# EAGLE schematic core (EAGLE 9.6.2)
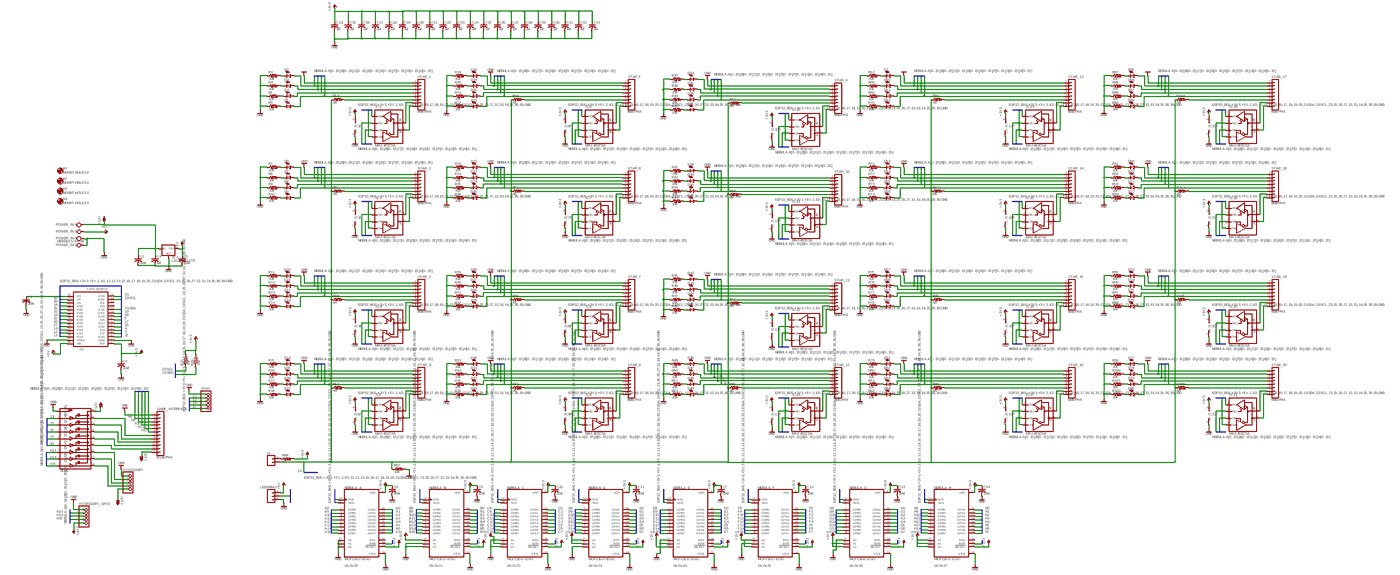
[diagram p0: schematic, sheet 1, overview]
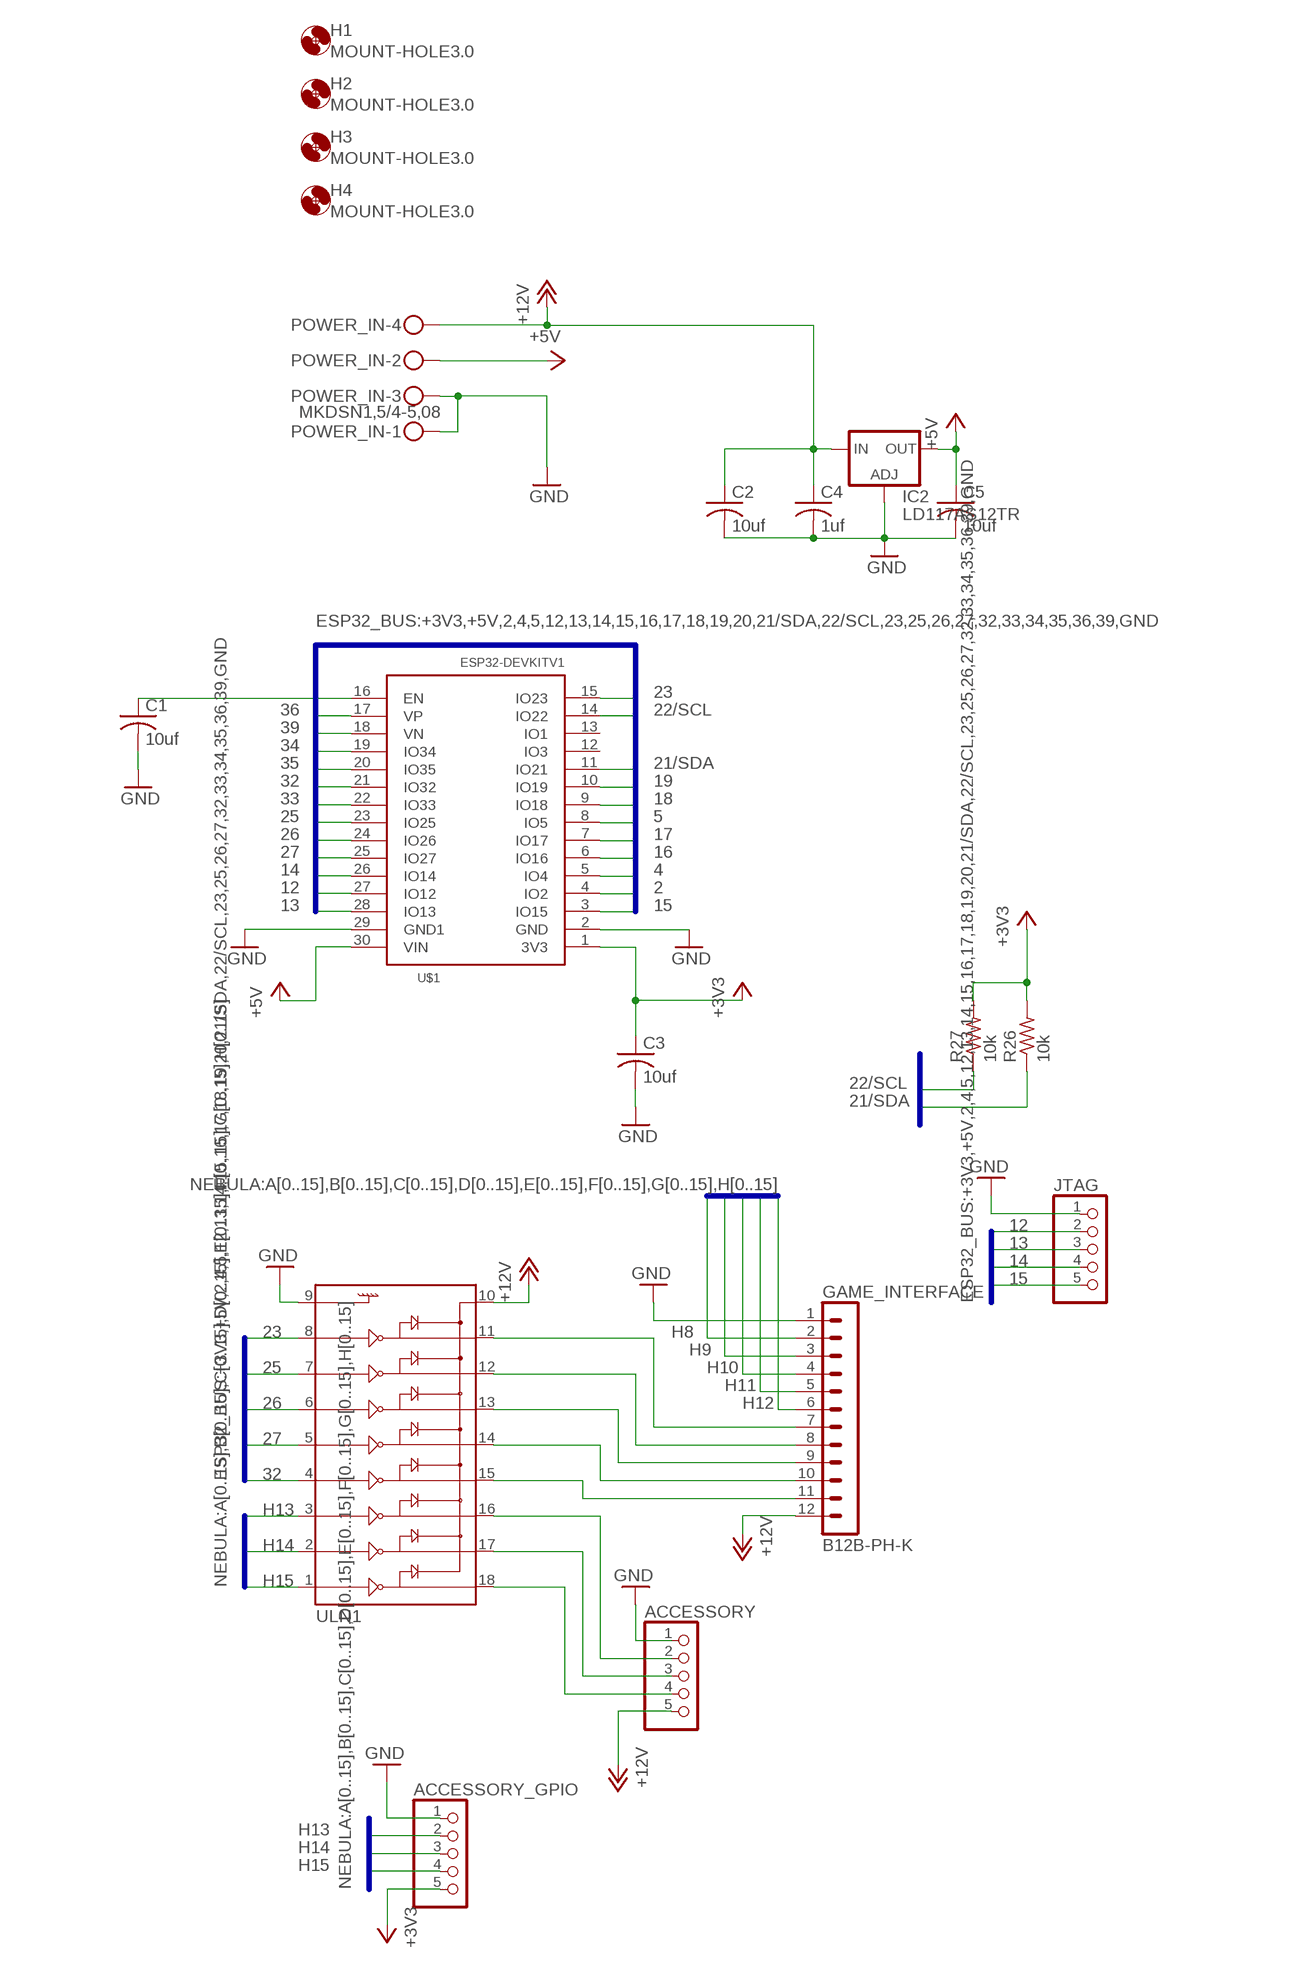
[diagram p1: schematic, sheet 1, part 1 of 4]
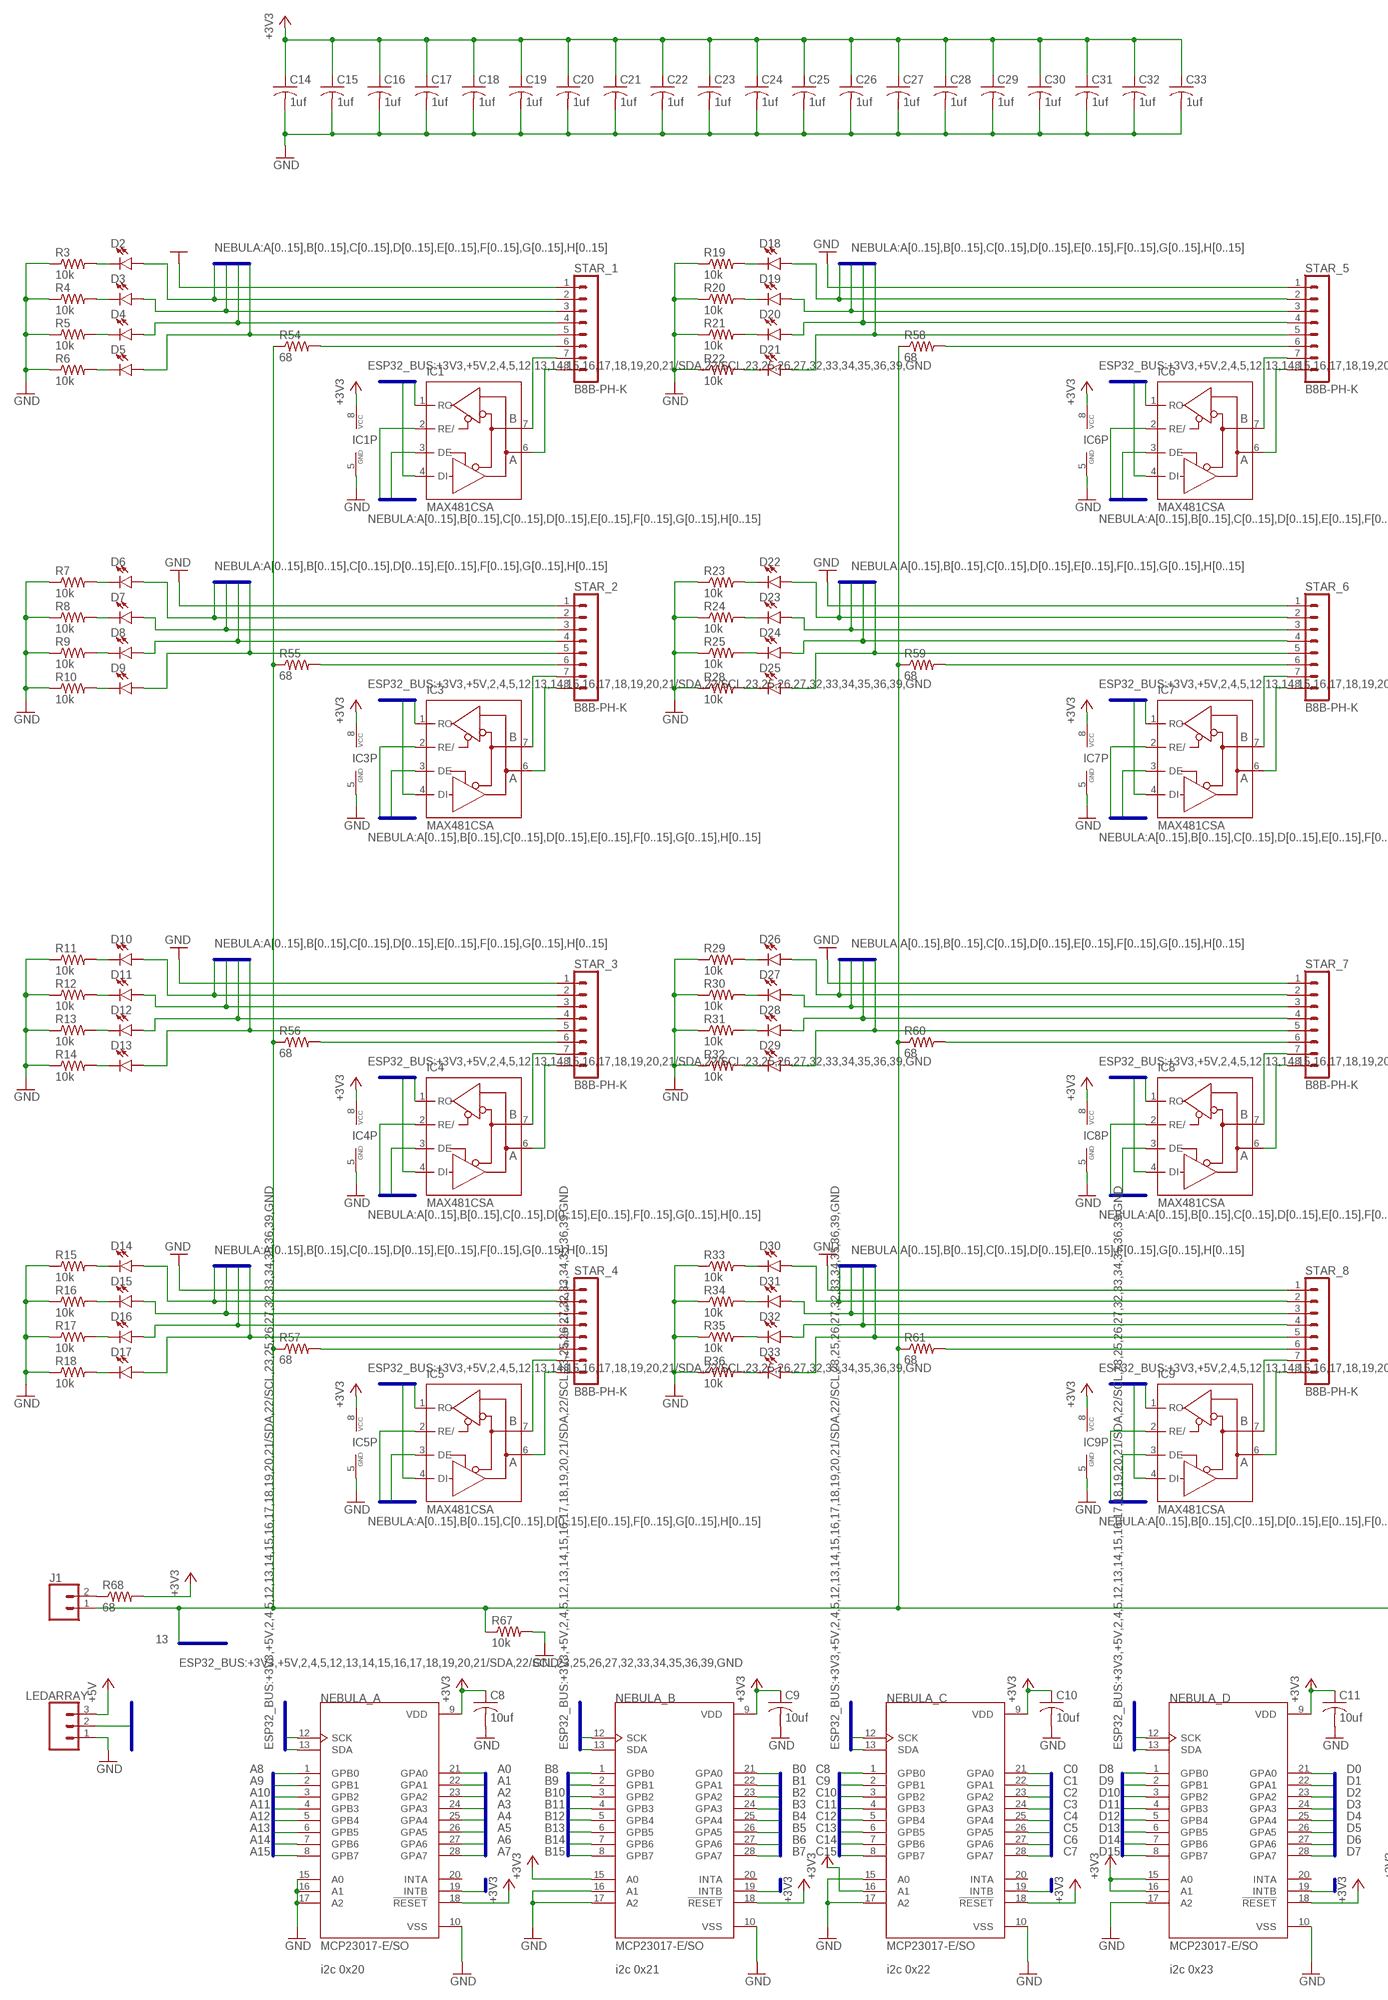
[diagram p2: schematic, sheet 1, part 2 of 4]
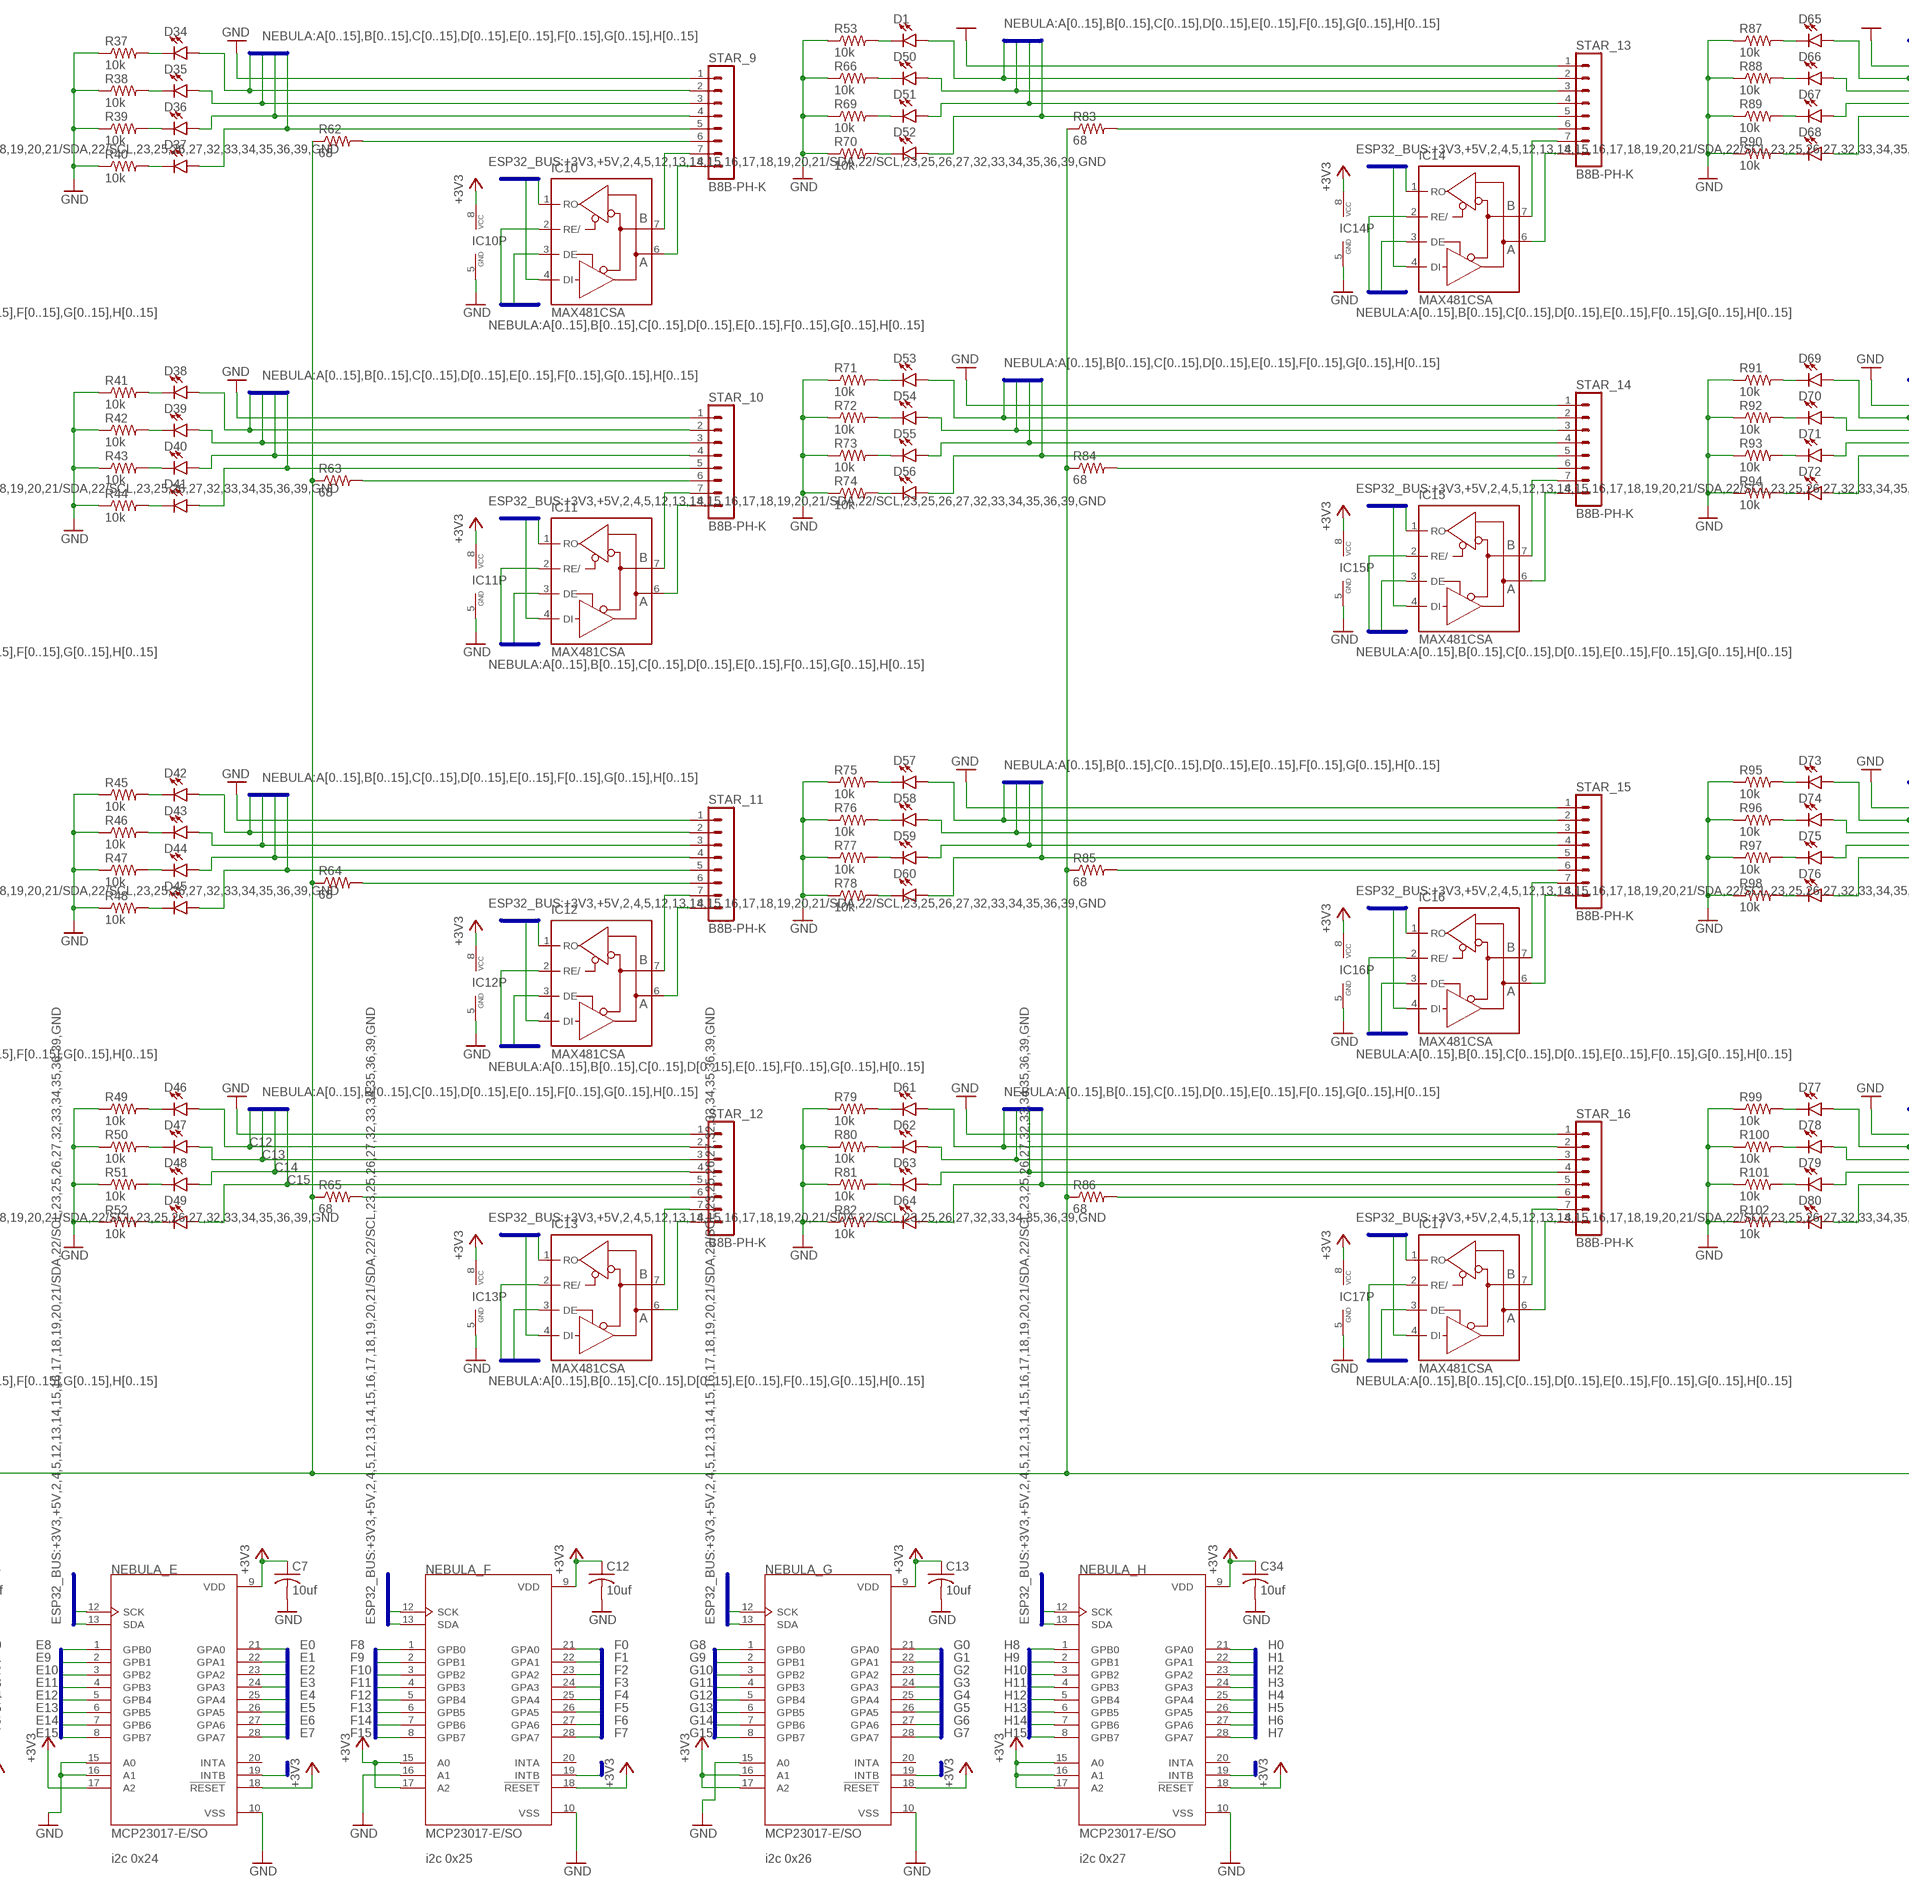
[diagram p3: schematic, sheet 1, part 3 of 4]
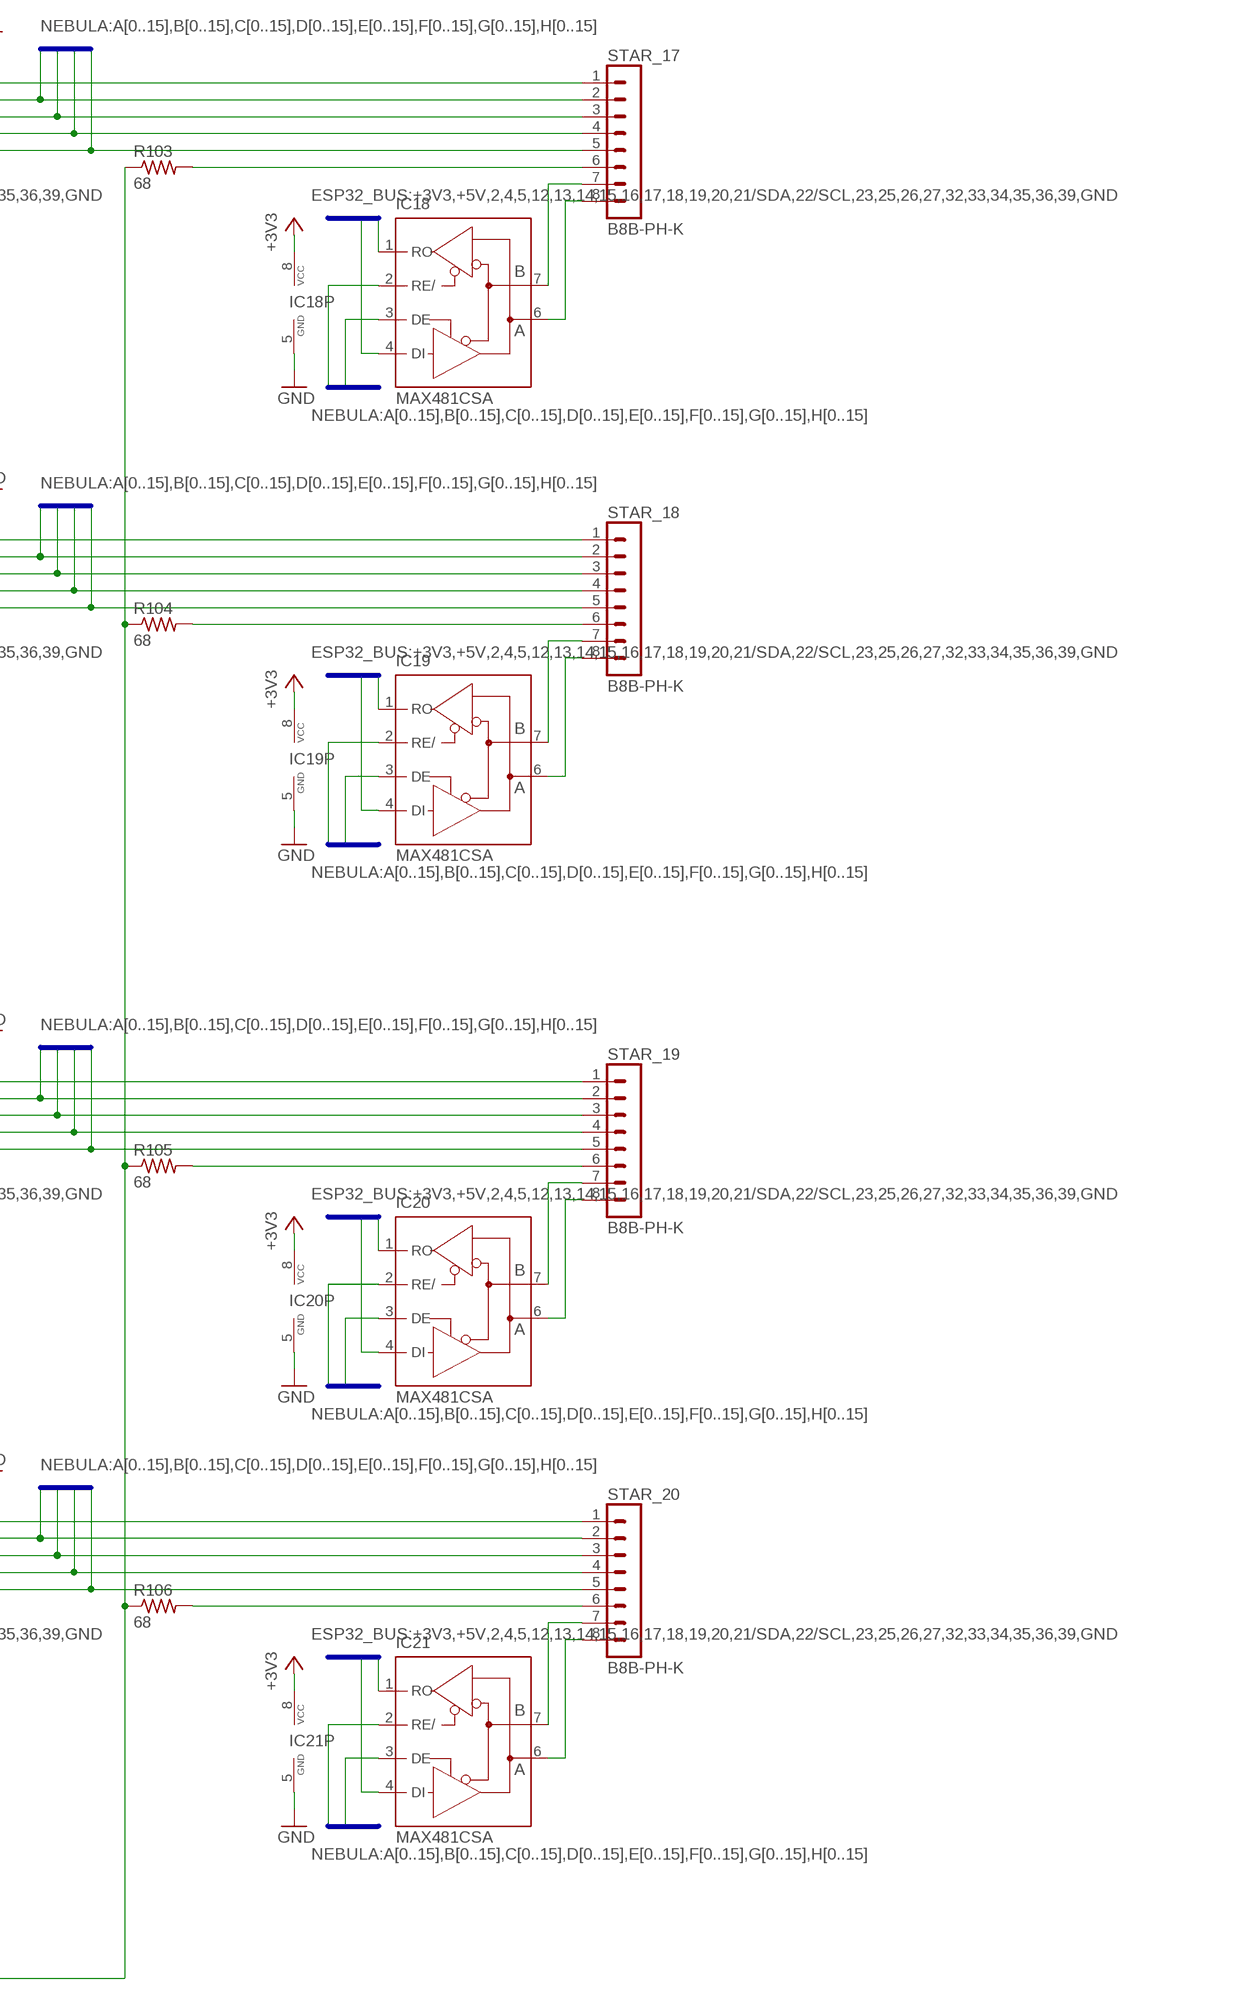
[diagram p4: schematic, sheet 1, part 4 of 4]

## Parts
ACCESSORY  PINHD-1X5  [1X05]
ACCESSORY_GPIO  PINHD-1X5  [1X05]
C1  10uf  C-USC0603  [C0603]
C2  10uf  C-USC0603  [C0603]
C3  10uf  C-USC0603  [C0603]
C4  1uf  C-USC0805  [C0805]
C5  10uf  C-USC0603  [C0603]
C7  10uf  C-USC0603  [C0603]
C8  10uf  C-USC0603  [C0603]
C9  10uf  C-USC0603  [C0603]
C10  10uf  C-USC0603  [C0603]
C11  10uf  C-USC0603  [C0603]
C12  10uf  C-USC0603  [C0603]
C13  10uf  C-USC0603  [C0603]
C14  1uf  C-USC0805  [C0805]
C15  1uf  C-USC0805  [C0805]
C16  1uf  C-USC0805  [C0805]
C17  1uf  C-USC0805  [C0805]
C18  1uf  C-USC0805  [C0805]
C19  1uf  C-USC0805  [C0805]
C20  1uf  C-USC0805  [C0805]
C21  1uf  C-USC0805  [C0805]
C22  1uf  C-USC0805  [C0805]
C23  1uf  C-USC0805  [C0805]
C24  1uf  C-USC0805  [C0805]
C25  1uf  C-USC0805  [C0805]
C26  1uf  C-USC0805  [C0805]
C27  1uf  C-USC0805  [C0805]
C28  1uf  C-USC0805  [C0805]
C29  1uf  C-USC0805  [C0805]
C30  1uf  C-USC0805  [C0805]
C31  1uf  C-USC0805  [C0805]
C32  1uf  C-USC0805  [C0805]
C33  1uf  C-USC0805  [C0805]
C34  10uf  C-USC0603  [C0603]
D1  LED0603  [LED-0603]
D2  LED0603  [LED-0603]
D3  LED0603  [LED-0603]
D4  LED0603  [LED-0603]
D5  LED0603  [LED-0603]
D6  LED0603  [LED-0603]
D7  LED0603  [LED-0603]
D8  LED0603  [LED-0603]
D9  LED0603  [LED-0603]
D10  LED0603  [LED-0603]
D11  LED0603  [LED-0603]
D12  LED0603  [LED-0603]
D13  LED0603  [LED-0603]
D14  LED0603  [LED-0603]
D15  LED0603  [LED-0603]
D16  LED0603  [LED-0603]
D17  LED0603  [LED-0603]
D18  LED0603  [LED-0603]
D19  LED0603  [LED-0603]
D20  LED0603  [LED-0603]
D21  LED0603  [LED-0603]
D22  LED0603  [LED-0603]
D23  LED0603  [LED-0603]
D24  LED0603  [LED-0603]
D25  LED0603  [LED-0603]
D26  LED0603  [LED-0603]
D27  LED0603  [LED-0603]
D28  LED0603  [LED-0603]
D29  LED0603  [LED-0603]
D30  LED0603  [LED-0603]
D31  LED0603  [LED-0603]
D32  LED0603  [LED-0603]
D33  LED0603  [LED-0603]
D34  LED0603  [LED-0603]
D35  LED0603  [LED-0603]
D36  LED0603  [LED-0603]
D37  LED0603  [LED-0603]
D38  LED0603  [LED-0603]
D39  LED0603  [LED-0603]
D40  LED0603  [LED-0603]
D41  LED0603  [LED-0603]
D42  LED0603  [LED-0603]
D43  LED0603  [LED-0603]
D44  LED0603  [LED-0603]
D45  LED0603  [LED-0603]
D46  LED0603  [LED-0603]
D47  LED0603  [LED-0603]
D48  LED0603  [LED-0603]
D49  LED0603  [LED-0603]
D50  LED0603  [LED-0603]
D51  LED0603  [LED-0603]
D52  LED0603  [LED-0603]
D53  LED0603  [LED-0603]
D54  LED0603  [LED-0603]
D55  LED0603  [LED-0603]
D56  LED0603  [LED-0603]
D57  LED0603  [LED-0603]
D58  LED0603  [LED-0603]
D59  LED0603  [LED-0603]
D60  LED0603  [LED-0603]
D61  LED0603  [LED-0603]
D62  LED0603  [LED-0603]
D63  LED0603  [LED-0603]
D64  LED0603  [LED-0603]
D65  LED0603  [LED-0603]
D66  LED0603  [LED-0603]
D67  LED0603  [LED-0603]
D68  LED0603  [LED-0603]
D69  LED0603  [LED-0603]
D70  LED0603  [LED-0603]
D71  LED0603  [LED-0603]
D72  LED0603  [LED-0603]
D73  LED0603  [LED-0603]
D74  LED0603  [LED-0603]
D75  LED0603  [LED-0603]
D76  LED0603  [LED-0603]
D77  LED0603  [LED-0603]
D78  LED0603  [LED-0603]
D79  LED0603  [LED-0603]
D80  LED0603  [LED-0603]
GAME_INTERFACE  B12B-PH-K  [B12B-PH-K]
H1  MOUNT-HOLE3.0  [3,0]
H2  MOUNT-HOLE3.0  [3,0]
H3  MOUNT-HOLE3.0  [3,0]
H4  MOUNT-HOLE3.0  [3,0]
IC1  MAX481CSA  [SO08]
IC2  LD117AS12TR  [SOT223]
IC3  MAX481CSA  [SO08]
IC4  MAX481CSA  [SO08]
IC5  MAX481CSA  [SO08]
IC6  MAX481CSA  [SO08]
IC7  MAX481CSA  [SO08]
IC8  MAX481CSA  [SO08]
IC9  MAX481CSA  [SO08]
IC10  MAX481CSA  [SO08]
IC11  MAX481CSA  [SO08]
IC12  MAX481CSA  [SO08]
IC13  MAX481CSA  [SO08]
IC14  MAX481CSA  [SO08]
IC15  MAX481CSA  [SO08]
IC16  MAX481CSA  [SO08]
IC17  MAX481CSA  [SO08]
IC18  MAX481CSA  [SO08]
IC19  MAX481CSA  [SO08]
IC20  MAX481CSA  [SO08]
IC21  MAX481CSA  [SO08]
J1  CONN_02JST-PTH-2  [JST-2-PTH]
JTAG  PINHD-1X5  [1X05]
LEDARRAY  CONN_03  [1X03]
NEBULA_A  MCP23017-E/SO  [SOIC127P1030X265-28N]
NEBULA_B  MCP23017-E/SO  [SOIC127P1030X265-28N]
NEBULA_C  MCP23017-E/SO  [SOIC127P1030X265-28N]
NEBULA_D  MCP23017-E/SO  [SOIC127P1030X265-28N]
NEBULA_E  MCP23017-E/SO  [SOIC127P1030X265-28N]
NEBULA_F  MCP23017-E/SO  [SOIC127P1030X265-28N]
NEBULA_G  MCP23017-E/SO  [SOIC127P1030X265-28N]
NEBULA_H  MCP23017-E/SO  [SOIC127P1030X265-28N]
POWER_IN  MKDSN1,5/4-5,08  [MKDSN1,5/4-5,08]
R3  10k  R-US_R0603  [R0603]
R4  10k  R-US_R0603  [R0603]
R5  10k  R-US_R0603  [R0603]
R6  10k  R-US_R0603  [R0603]
R7  10k  R-US_R0603  [R0603]
R8  10k  R-US_R0603  [R0603]
R9  10k  R-US_R0603  [R0603]
R10  10k  R-US_R0603  [R0603]
R11  10k  R-US_R0603  [R0603]
R12  10k  R-US_R0603  [R0603]
R13  10k  R-US_R0603  [R0603]
R14  10k  R-US_R0603  [R0603]
R15  10k  R-US_R0603  [R0603]
R16  10k  R-US_R0603  [R0603]
R17  10k  R-US_R0603  [R0603]
R18  10k  R-US_R0603  [R0603]
R19  10k  R-US_R0603  [R0603]
R20  10k  R-US_R0603  [R0603]
R21  10k  R-US_R0603  [R0603]
R22  10k  R-US_R0603  [R0603]
R23  10k  R-US_R0603  [R0603]
R24  10k  R-US_R0603  [R0603]
R25  10k  R-US_R0603  [R0603]
R26  10k  R-US_R0603  [R0603]
R27  10k  R-US_R0603  [R0603]
R28  10k  R-US_R0603  [R0603]
R29  10k  R-US_R0603  [R0603]
R30  10k  R-US_R0603  [R0603]
R31  10k  R-US_R0603  [R0603]
R32  10k  R-US_R0603  [R0603]
R33  10k  R-US_R0603  [R0603]
R34  10k  R-US_R0603  [R0603]
R35  10k  R-US_R0603  [R0603]
R36  10k  R-US_R0603  [R0603]
R37  10k  R-US_R0603  [R0603]
R38  10k  R-US_R0603  [R0603]
R39  10k  R-US_R0603  [R0603]
R40  10k  R-US_R0603  [R0603]
R41  10k  R-US_R0603  [R0603]
R42  10k  R-US_R0603  [R0603]
R43  10k  R-US_R0603  [R0603]
R44  10k  R-US_R0603  [R0603]
R45  10k  R-US_R0603  [R0603]
R46  10k  R-US_R0603  [R0603]
R47  10k  R-US_R0603  [R0603]
R48  10k  R-US_R0603  [R0603]
R49  10k  R-US_R0603  [R0603]
R50  10k  R-US_R0603  [R0603]
R51  10k  R-US_R0603  [R0603]
R52  10k  R-US_R0603  [R0603]
R53  10k  R-US_R0603  [R0603]
R54  68  R-US_R0603  [R0603]
R55  68  R-US_R0603  [R0603]
R56  68  R-US_R0603  [R0603]
R57  68  R-US_R0603  [R0603]
R58  68  R-US_R0603  [R0603]
R59  68  R-US_R0603  [R0603]
R60  68  R-US_R0603  [R0603]
R61  68  R-US_R0603  [R0603]
R62  68  R-US_R0603  [R0603]
R63  68  R-US_R0603  [R0603]
R64  68  R-US_R0603  [R0603]
R65  68  R-US_R0603  [R0603]
R66  10k  R-US_R0603  [R0603]
R67  10k  R-US_R0603  [R0603]
R68  68  R-US_R0603  [R0603]
R69  10k  R-US_R0603  [R0603]
R70  10k  R-US_R0603  [R0603]
R71  10k  R-US_R0603  [R0603]
R72  10k  R-US_R0603  [R0603]
R73  10k  R-US_R0603  [R0603]
R74  10k  R-US_R0603  [R0603]
R75  10k  R-US_R0603  [R0603]
R76  10k  R-US_R0603  [R0603]
R77  10k  R-US_R0603  [R0603]
R78  10k  R-US_R0603  [R0603]
R79  10k  R-US_R0603  [R0603]
R80  10k  R-US_R0603  [R0603]
R81  10k  R-US_R0603  [R0603]
R82  10k  R-US_R0603  [R0603]
R83  68  R-US_R0603  [R0603]
R84  68  R-US_R0603  [R0603]
R85  68  R-US_R0603  [R0603]
R86  68  R-US_R0603  [R0603]
R87  10k  R-US_R0603  [R0603]
R88  10k  R-US_R0603  [R0603]
R89  10k  R-US_R0603  [R0603]
R90  10k  R-US_R0603  [R0603]
R91  10k  R-US_R0603  [R0603]
R92  10k  R-US_R0603  [R0603]
R93  10k  R-US_R0603  [R0603]
R94  10k  R-US_R0603  [R0603]
R95  10k  R-US_R0603  [R0603]
R96  10k  R-US_R0603  [R0603]
R97  10k  R-US_R0603  [R0603]
R98  10k  R-US_R0603  [R0603]
R99  10k  R-US_R0603  [R0603]
R100  10k  R-US_R0603  [R0603]
R101  10k  R-US_R0603  [R0603]
R102  10k  R-US_R0603  [R0603]
R103  68  R-US_R0603  [R0603]
R104  68  R-US_R0603  [R0603]
R105  68  R-US_R0603  [R0603]
R106  68  R-US_R0603  [R0603]
STAR_1  B8B-PH-K  [B8B-PH-K]
STAR_2  B8B-PH-K  [B8B-PH-K]
STAR_3  B8B-PH-K  [B8B-PH-K]
STAR_4  B8B-PH-K  [B8B-PH-K]
STAR_5  B8B-PH-K  [B8B-PH-K]
STAR_6  B8B-PH-K  [B8B-PH-K]
STAR_7  B8B-PH-K  [B8B-PH-K]
STAR_8  B8B-PH-K  [B8B-PH-K]
STAR_9  B8B-PH-K  [B8B-PH-K]
STAR_10  B8B-PH-K  [B8B-PH-K]
STAR_11  B8B-PH-K  [B8B-PH-K]
STAR_12  B8B-PH-K  [B8B-PH-K]
STAR_13  B8B-PH-K  [B8B-PH-K]
STAR_14  B8B-PH-K  [B8B-PH-K]
STAR_15  B8B-PH-K  [B8B-PH-K]
STAR_16  B8B-PH-K  [B8B-PH-K]
STAR_17  B8B-PH-K  [B8B-PH-K]
STAR_18  B8B-PH-K  [B8B-PH-K]
STAR_19  B8B-PH-K  [B8B-PH-K]
STAR_20  B8B-PH-K  [B8B-PH-K]
U$1  ESP32DEVKITV1  [ESP32-DEVKITV1]
ULN1  ULN2803SOIC  [SO018]

## Nets
2: U$1.4(IO2)
4: LEDARRAY.2 U$1.5(IO4)
5: U$1.8(IO5)
12: JTAG.2 U$1.27(IO12)
13: J1.1 JTAG.3 R54.1 R55.1 R56.1 R57.1 R58.1 R59.1 R60.1 R61.1 R62.1 R63.1 R64.1 R65.1 R67.1 R83.1 R84.1 R85.1 R86.1 R103.1 R104.1 R105.1 R106.1 U$1.28(IO13)
14: JTAG.4 U$1.26(IO14)
15: JTAG.5 U$1.3(IO15)
16: IC1.1(RO) IC3.1(RO) IC4.1(RO) IC5.1(RO) IC6.1(RO) IC7.1(RO) IC8.1(RO) IC9.1(RO) IC10.1(RO) IC11.1(RO) IC12.1(RO) IC13.1(RO) IC14.1(RO) IC15.1(RO) IC16.1(RO) IC17.1(RO) IC18.1(RO) IC19.1(RO) IC20.1(RO) IC21.1(RO) U$1.6(IO16)
17: IC1.4(DI) IC3.4(DI) IC4.4(DI) IC5.4(DI) IC6.4(DI) IC7.4(DI) IC8.4(DI) IC9.4(DI) IC10.4(DI) IC11.4(DI) IC12.4(DI) IC13.4(DI) IC14.4(DI) IC15.4(DI) IC16.4(DI) IC17.4(DI) IC18.4(DI) IC19.4(DI) IC20.4(DI) IC21.4(DI) U$1.7(IO17)
18: NEBULA_E.19(INTB) U$1.9(IO18)
19: NEBULA_F.19(INTB) U$1.10(IO19)
21/SDA: NEBULA_A.13(SDA) NEBULA_B.13(SDA) NEBULA_C.13(SDA) NEBULA_D.13(SDA) NEBULA_E.13(SDA) NEBULA_F.13(SDA) NEBULA_G.13(SDA) NEBULA_H.13(SDA) R26.1 U$1.11(IO21)
22/SCL: NEBULA_A.12(SCK) NEBULA_B.12(SCK) NEBULA_C.12(SCK) NEBULA_D.12(SCK) NEBULA_E.12(SCK) NEBULA_F.12(SCK) NEBULA_G.12(SCK) NEBULA_H.12(SCK) R27.1 U$1.14(IO22)
23: U$1.15(IO23) ULN1.8
25: U$1.23(IO25) ULN1.7
26: U$1.24(IO26) ULN1.6
27: U$1.25(IO27) ULN1.5
32: U$1.21(IO32) ULN1.4
33: NEBULA_G.19(INTB) NEBULA_H.19(INTB) U$1.22(IO33)
34: NEBULA_A.19(INTB) U$1.19(IO34)
35: NEBULA_B.19(INTB) U$1.20(IO35)
36: NEBULA_C.19(INTB) U$1.17(VP)
39: NEBULA_D.19(INTB) U$1.18(VN)
+3V3 [3V3]: ACCESSORY_GPIO.5 C3.1 C7.1 C8.1 C9.1 C10.1 C11.1 C12.1 C13.1 C14.1 C15.1 C16.1 C17.1 C18.1 C19.1 C20.1 C21.1 C22.1 C23.1 C24.1 C25.1 C26.1 C27.1 C28.1 C29.1 C30.1 C31.1 C32.1 C33.1 C34.1 IC1.8(VCC) IC3.8(VCC) IC4.8(VCC) IC5.8(VCC) IC6.8(VCC) IC7.8(VCC) IC8.8(VCC) IC9.8(VCC) IC10.8(VCC) IC11.8(VCC) IC12.8(VCC) IC13.8(VCC) IC14.8(VCC) IC15.8(VCC) IC16.8(VCC) IC17.8(VCC) IC18.8(VCC) IC19.8(VCC) IC20.8(VCC) IC21.8(VCC) NEBULA_A.9(VDD) NEBULA_A.18(!RESET) NEBULA_B.9(VDD) NEBULA_B.15(A0) NEBULA_B.18(!RESET) NEBULA_C.9(VDD) NEBULA_C.16(A1) NEBULA_C.18(!RESET) NEBULA_D.9(VDD) NEBULA_D.15(A0) NEBULA_D.16(A1) NEBULA_D.18(!RESET) NEBULA_E.9(VDD) NEBULA_E.17(A2) NEBULA_E.18(!RESET) NEBULA_F.9(VDD) NEBULA_F.15(A0) NEBULA_F.17(A2) NEBULA_F.18(!RESET) NEBULA_G.9(VDD) NEBULA_G.16(A1) NEBULA_G.17(A2) NEBULA_G.18(!RESET) NEBULA_H.9(VDD) NEBULA_H.15(A0) NEBULA_H.16(A1) NEBULA_H.17(A2) NEBULA_H.18(!RESET) R26.2 R27.2 R68.2 U$1.1(3V3)
+5V [5V]: C5.1 IC2.4(OUT) LEDARRAY.3 POWER_IN.2 U$1.30(VIN)
+12V [12V]: ACCESSORY.5 C2.1 C4.1 GAME_INTERFACE.12 IC2.3(IN) POWER_IN.4 ULN1.10
A0: D2.A NEBULA_A.21(GPA0) STAR_1.2
A1: D3.A NEBULA_A.22(GPA1) STAR_1.3
A2: D4.A NEBULA_A.23(GPA2) STAR_1.4
A3: D5.A NEBULA_A.24(GPA3) STAR_1.5
A4: D6.A NEBULA_A.25(GPA4) STAR_2.2
A5: D7.A NEBULA_A.26(GPA5) STAR_2.3
A6: D8.A NEBULA_A.27(GPA6) STAR_2.4
A7: D9.A NEBULA_A.28(GPA7) STAR_2.5
A8: D10.A NEBULA_A.1(GPB0) STAR_3.2
A9: D11.A NEBULA_A.2(GPB1) STAR_3.3
A10: D12.A NEBULA_A.3(GPB2) STAR_3.4
A11: D13.A NEBULA_A.4(GPB3) STAR_3.5
A12: D14.A NEBULA_A.5(GPB4) STAR_4.2
A13: D15.A NEBULA_A.6(GPB5) STAR_4.3
A14: D16.A NEBULA_A.7(GPB6) STAR_4.4
A15: D17.A NEBULA_A.8(GPB7) STAR_4.5
B0: D18.A NEBULA_B.21(GPA0) STAR_5.2
B1: D19.A NEBULA_B.22(GPA1) STAR_5.3
B2: D20.A NEBULA_B.23(GPA2) STAR_5.4
B3: D21.A NEBULA_B.24(GPA3) STAR_5.5
B4: D22.A NEBULA_B.25(GPA4) STAR_6.2
B5: D23.A NEBULA_B.26(GPA5) STAR_6.3
B6: D24.A NEBULA_B.27(GPA6) STAR_6.4
B7: D25.A NEBULA_B.28(GPA7) STAR_6.5
B8: D26.A NEBULA_B.1(GPB0) STAR_7.2
B9: D27.A NEBULA_B.2(GPB1) STAR_7.3
B10: D28.A NEBULA_B.3(GPB2) STAR_7.4
B11: D29.A NEBULA_B.4(GPB3) STAR_7.5
B12: D30.A NEBULA_B.5(GPB4) STAR_8.2
B13: D31.A NEBULA_B.6(GPB5) STAR_8.3
B14: D32.A NEBULA_B.7(GPB6) STAR_8.4
B15: D33.A NEBULA_B.8(GPB7) STAR_8.5
C0: D34.A NEBULA_C.21(GPA0) STAR_9.2
C1: D35.A NEBULA_C.22(GPA1) STAR_9.3
C2: D36.A NEBULA_C.23(GPA2) STAR_9.4
C3: D37.A NEBULA_C.24(GPA3) STAR_9.5
C4: D38.A NEBULA_C.25(GPA4) STAR_10.2
C5: D39.A NEBULA_C.26(GPA5) STAR_10.3
C6: D40.A NEBULA_C.27(GPA6) STAR_10.4
C7: D41.A NEBULA_C.28(GPA7) STAR_10.5
C8: D42.A NEBULA_C.1(GPB0) STAR_11.2
C9: D43.A NEBULA_C.2(GPB1) STAR_11.3
C10: D44.A NEBULA_C.3(GPB2) STAR_11.4
C11: D45.A NEBULA_C.4(GPB3) STAR_11.5
C12: D46.A NEBULA_C.5(GPB4) STAR_12.2
C13: D47.A NEBULA_C.6(GPB5) STAR_12.3
C14: D48.A NEBULA_C.7(GPB6) STAR_12.4
C15: D49.A NEBULA_C.8(GPB7) STAR_12.5
D0: D1.A NEBULA_D.21(GPA0) STAR_13.2
D1: D50.A NEBULA_D.22(GPA1) STAR_13.3
D2: D51.A NEBULA_D.23(GPA2) STAR_13.4
D3: D52.A NEBULA_D.24(GPA3) STAR_13.5
D4: D53.A NEBULA_D.25(GPA4) STAR_14.2
D5: D54.A NEBULA_D.26(GPA5) STAR_14.3
D6: D55.A NEBULA_D.27(GPA6) STAR_14.4
D7: D56.A NEBULA_D.28(GPA7) STAR_14.5
D8: D57.A NEBULA_D.1(GPB0) STAR_15.2
D9: D58.A NEBULA_D.2(GPB1) STAR_15.3
D10: D59.A NEBULA_D.3(GPB2) STAR_15.4
D11: D60.A NEBULA_D.4(GPB3) STAR_15.5
D12: D61.A NEBULA_D.5(GPB4) STAR_16.2
D13: D62.A NEBULA_D.6(GPB5) STAR_16.3
D14: D63.A NEBULA_D.7(GPB6) STAR_16.4
D15: D64.A NEBULA_D.8(GPB7) STAR_16.5
E0: D65.A NEBULA_E.21(GPA0) STAR_17.2
E1: D66.A NEBULA_E.22(GPA1) STAR_17.3
E2: D67.A NEBULA_E.23(GPA2) STAR_17.4
E3: D68.A NEBULA_E.24(GPA3) STAR_17.5
E4: D69.A NEBULA_E.25(GPA4) STAR_18.2
E5: D70.A NEBULA_E.26(GPA5) STAR_18.3
E6: D71.A NEBULA_E.27(GPA6) STAR_18.4
E7: D72.A NEBULA_E.28(GPA7) STAR_18.5
E8: D73.A NEBULA_E.1(GPB0) STAR_19.2
E9: D74.A NEBULA_E.2(GPB1) STAR_19.3
E10: D75.A NEBULA_E.3(GPB2) STAR_19.4
E11: D76.A NEBULA_E.4(GPB3) STAR_19.5
E12: D77.A NEBULA_E.5(GPB4) STAR_20.2
E13: D78.A NEBULA_E.6(GPB5) STAR_20.3
E14: D79.A NEBULA_E.7(GPB6) STAR_20.4
E15: D80.A NEBULA_E.8(GPB7) STAR_20.5
F0: IC1.2(RE/) NEBULA_F.21(GPA0)
F1: IC1.3(DE) NEBULA_F.22(GPA1)
F2: IC3.2(RE/) NEBULA_F.23(GPA2)
F3: IC3.3(DE) NEBULA_F.24(GPA3)
F4: IC4.2(RE/) NEBULA_F.25(GPA4)
F5: IC4.3(DE) NEBULA_F.26(GPA5)
F6: IC5.2(RE/) NEBULA_F.27(GPA6)
F7: IC5.3(DE) NEBULA_F.28(GPA7)
F8: IC6.2(RE/) NEBULA_F.1(GPB0)
F9: IC6.3(DE) NEBULA_F.2(GPB1)
F10: IC7.2(RE/) NEBULA_F.3(GPB2)
F11: IC7.3(DE) NEBULA_F.4(GPB3)
F12: IC8.2(RE/) NEBULA_F.5(GPB4)
F13: IC8.3(DE) NEBULA_F.6(GPB5)
F14: IC9.2(RE/) NEBULA_F.7(GPB6)
F15: IC9.3(DE) NEBULA_F.8(GPB7)
G0: IC10.2(RE/) NEBULA_G.21(GPA0)
G1: IC10.3(DE) NEBULA_G.22(GPA1)
G2: IC11.2(RE/) NEBULA_G.23(GPA2)
G3: IC11.3(DE) NEBULA_G.24(GPA3)
G4: IC12.2(RE/) NEBULA_G.25(GPA4)
G5: IC12.3(DE) NEBULA_G.26(GPA5)
G6: IC13.2(RE/) NEBULA_G.27(GPA6)
G7: IC13.3(DE) NEBULA_G.28(GPA7)
G8: IC14.2(RE/) NEBULA_G.1(GPB0)
G9: IC14.3(DE) NEBULA_G.2(GPB1)
G10: IC15.2(RE/) NEBULA_G.3(GPB2)
G11: IC15.3(DE) NEBULA_G.4(GPB3)
G12: IC16.2(RE/) NEBULA_G.5(GPB4)
G13: IC16.3(DE) NEBULA_G.6(GPB5)
G14: IC17.2(RE/) NEBULA_G.7(GPB6)
G15: IC17.3(DE) NEBULA_G.8(GPB7)
GND [GND]: ACCESSORY.1 ACCESSORY_GPIO.1 C1.2 C2.2 C3.2 C4.2 C5.2 C7.2 C8.2 C9.2 C10.2 C11.2 C12.2 C13.2 C14.2 C15.2 C16.2 C17.2 C18.2 C19.2 C20.2 C21.2 C22.2 C23.2 C24.2 C25.2 C26.2 C27.2 C28.2 C29.2 C30.2 C31.2 C32.2 C33.2 C34.2 GAME_INTERFACE.1 IC1.5(GND) IC2.1(ADJ) IC3.5(GND) IC4.5(GND) IC5.5(GND) IC6.5(GND) IC7.5(GND) IC8.5(GND) IC9.5(GND) IC10.5(GND) IC11.5(GND) IC12.5(GND) IC13.5(GND) IC14.5(GND) IC15.5(GND) IC16.5(GND) IC17.5(GND) IC18.5(GND) IC19.5(GND) IC20.5(GND) IC21.5(GND) JTAG.1 LEDARRAY.1 NEBULA_A.10(VSS) NEBULA_A.15(A0) NEBULA_A.16(A1) NEBULA_A.17(A2) NEBULA_B.10(VSS) NEBULA_B.16(A1) NEBULA_B.17(A2) NEBULA_C.10(VSS) NEBULA_C.15(A0) NEBULA_C.17(A2) NEBULA_D.10(VSS) NEBULA_D.17(A2) NEBULA_E.10(VSS) NEBULA_E.15(A0) NEBULA_E.16(A1) NEBULA_F.10(VSS) NEBULA_F.16(A1) NEBULA_G.10(VSS) NEBULA_G.15(A0) NEBULA_H.10(VSS) POWER_IN.1 POWER_IN.3 R3.1 R4.1 R5.1 R6.1 R7.1 R8.1 R9.1 R10.1 R11.1 R12.1 R13.1 R14.1 R15.1 R16.1 R17.1 R18.1 R19.1 R20.1 R21.1 R22.1 R23.1 R24.1 R25.1 R28.1 R29.1 R30.1 R31.1 R32.1 R33.1 R34.1 R35.1 R36.1 R37.1 R38.1 R39.1 R40.1 R41.1 R42.1 R43.1 R44.1 R45.1 R46.1 R47.1 R48.1 R49.1 R50.1 R51.1 R52.1 R53.1 R66.1 R67.2 R69.1 R70.1 R71.1 R72.1 R73.1 R74.1 R75.1 R76.1 R77.1 R78.1 R79.1 R80.1 R81.1 R82.1 R87.1 R88.1 R89.1 R90.1 R91.1 R92.1 R93.1 R94.1 R95.1 R96.1 R97.1 R98.1 R99.1 R100.1 R101.1 R102.1 STAR_1.1 STAR_2.1 STAR_3.1 STAR_4.1 STAR_5.1 STAR_6.1 STAR_7.1 STAR_8.1 STAR_9.1 STAR_10.1 STAR_11.1 STAR_12.1 STAR_13.1 STAR_14.1 STAR_15.1 STAR_16.1 STAR_17.1 STAR_18.1 STAR_19.1 STAR_20.1 U$1.2(GND) U$1.29(GND1) ULN1.9
H0: IC18.2(RE/) NEBULA_H.21(GPA0)
H1: IC18.3(DE) NEBULA_H.22(GPA1)
H2: IC19.2(RE/) NEBULA_H.23(GPA2)
H3: IC19.3(DE) NEBULA_H.24(GPA3)
H4: IC20.2(RE/) NEBULA_H.25(GPA4)
H5: IC20.3(DE) NEBULA_H.26(GPA5)
H6: IC21.2(RE/) NEBULA_H.27(GPA6)
H7: IC21.3(DE) NEBULA_H.28(GPA7)
H8: GAME_INTERFACE.2 NEBULA_H.1(GPB0)
H9: GAME_INTERFACE.3 NEBULA_H.2(GPB1)
H10: GAME_INTERFACE.4 NEBULA_H.3(GPB2)
H11: GAME_INTERFACE.5 NEBULA_H.4(GPB3)
H12: GAME_INTERFACE.6 NEBULA_H.5(GPB4)
H13: ACCESSORY_GPIO.2 NEBULA_H.6(GPB5) ULN1.3
H14: ACCESSORY_GPIO.3 NEBULA_H.7(GPB6) ULN1.2
H15: ACCESSORY_GPIO.4 NEBULA_H.8(GPB7) ULN1.1
N$1: C1.1 U$1.16(EN)
N$2: R55.2 STAR_2.6
N$3: D2.C R3.2
N$4: D3.C R4.2
N$5: D4.C R5.2
N$6: D5.C R6.2
N$7: R56.2 STAR_3.6
N$8: R57.2 STAR_4.6
N$9: R54.2 STAR_1.6
N$10: R58.2 STAR_5.6
N$11: D6.C R7.2
N$12: D7.C R8.2
N$13: D8.C R9.2
N$14: D9.C R10.2
N$15: R59.2 STAR_6.6
N$16: R60.2 STAR_7.6
N$17: R61.2 STAR_8.6
N$18: R65.2 STAR_12.6
N$19: R64.2 STAR_11.6
N$20: D10.C R11.2
N$21: D11.C R12.2
N$22: D12.C R13.2
N$23: D13.C R14.2
N$24: R63.2 STAR_10.6
N$25: R62.2 STAR_9.6
N$26: D1.C R53.2
N$27: D50.C R66.2
N$28: D14.C R15.2
N$29: D15.C R16.2
N$30: D16.C R17.2
N$31: D17.C R18.2
N$32: D51.C R69.2
N$33: D52.C R70.2
N$34: D65.C R87.2
N$35: D53.C R71.2
N$36: D18.C R19.2
N$37: D19.C R20.2
N$38: D20.C R21.2
N$39: D21.C R22.2
N$40: D54.C R72.2
N$41: D55.C R73.2
N$42: D56.C R74.2
N$43: D57.C R75.2
N$44: D22.C R23.2
N$45: D23.C R24.2
N$46: D24.C R25.2
N$47: D25.C R28.2
N$48: D58.C R76.2
N$49: D59.C R77.2
N$50: D60.C R78.2
N$51: GAME_INTERFACE.7 ULN1.11
N$52: D26.C R29.2
N$53: D27.C R30.2
N$54: D28.C R31.2
N$55: D29.C R32.2
N$56: GAME_INTERFACE.8 ULN1.12
N$57: GAME_INTERFACE.9 ULN1.13
N$58: GAME_INTERFACE.10 ULN1.14
N$59: GAME_INTERFACE.11 ULN1.15
N$60: D30.C R33.2
N$61: D31.C R34.2
N$62: D32.C R35.2
N$63: D33.C R36.2
N$64: D61.C R79.2
N$65: D62.C R80.2
N$66: D63.C R81.2
N$67: D64.C R82.2
N$68: D34.C R37.2
N$69: D35.C R38.2
N$70: D36.C R39.2
N$71: D37.C R40.2
N$72: R84.2 STAR_14.6
N$73: R85.2 STAR_15.6
N$74: R86.2 STAR_16.6
N$75: R83.2 STAR_13.6
N$76: D38.C R41.2
N$77: D39.C R42.2
N$78: D40.C R43.2
N$79: D41.C R44.2
N$80: D66.C R88.2
N$81: D67.C R89.2
N$82: D68.C R90.2
N$83: D69.C R91.2
N$84: D42.C R45.2
N$85: D43.C R46.2
N$86: D44.C R47.2
N$87: D45.C R48.2
N$88: D70.C R92.2
N$89: J1.2 R68.1
N$90: D71.C R93.2
N$91: D72.C R94.2
N$92: D73.C R95.2
N$93: D46.C R49.2
N$94: D47.C R50.2
N$95: D48.C R51.2
N$96: D49.C R52.2
N$97: D74.C R96.2
N$98: D75.C R97.2
N$99: D76.C R98.2
N$100: D77.C R99.2
N$101: D78.C R100.2
N$102: D79.C R101.2
N$103: D80.C R102.2
N$104: R104.2 STAR_18.6
N$105: R105.2 STAR_19.6
N$106: R106.2 STAR_20.6
N$107: R103.2 STAR_17.6
N$108: IC1.7(B) STAR_1.7
N$109: IC1.6(A) STAR_1.8
N$110: IC3.7(B) STAR_2.7
N$111: IC3.6(A) STAR_2.8
N$112: IC4.7(B) STAR_3.7
N$113: IC4.6(A) STAR_3.8
N$114: IC5.7(B) STAR_4.7
N$115: IC5.6(A) STAR_4.8
N$116: IC6.7(B) STAR_5.7
N$117: IC6.6(A) STAR_5.8
N$118: IC7.7(B) STAR_6.7
N$119: IC7.6(A) STAR_6.8
N$120: IC8.7(B) STAR_7.7
N$121: IC8.6(A) STAR_7.8
N$122: IC9.7(B) STAR_8.7
N$123: IC9.6(A) STAR_8.8
N$124: IC10.7(B) STAR_9.7
N$125: IC10.6(A) STAR_9.8
N$126: IC11.7(B) STAR_10.7
N$127: IC11.6(A) STAR_10.8
N$128: IC12.7(B) STAR_11.7
N$129: IC12.6(A) STAR_11.8
N$130: IC13.7(B) STAR_12.7
N$131: IC13.6(A) STAR_12.8
N$132: IC14.7(B) STAR_13.7
N$133: IC14.6(A) STAR_13.8
N$134: IC15.7(B) STAR_14.7
N$135: IC15.6(A) STAR_14.8
N$136: IC16.7(B) STAR_15.7
N$137: IC16.6(A) STAR_15.8
N$138: IC17.7(B) STAR_16.7
N$139: IC17.6(A) STAR_16.8
N$140: IC18.7(B) STAR_17.7
N$141: IC18.6(A) STAR_17.8
N$142: IC19.7(B) STAR_18.7
N$143: IC19.6(A) STAR_18.8
N$144: IC20.7(B) STAR_19.7
N$145: IC20.6(A) STAR_19.8
N$146: IC21.7(B) STAR_20.7
N$147: IC21.6(A) STAR_20.8
N$148: ACCESSORY.2 ULN1.16
N$149: ACCESSORY.3 ULN1.17
N$150: ACCESSORY.4 ULN1.18
Unconnected: NEBULA_A.20(INTA) NEBULA_B.20(INTA) NEBULA_C.20(INTA) NEBULA_D.20(INTA) NEBULA_E.20(INTA) NEBULA_F.20(INTA) NEBULA_G.20(INTA) NEBULA_H.20(INTA) U$1.12(IO3) U$1.13(IO1)

## Buses
ESP32_BUS:+3V3,+5V,2,4,5,12,13,14,15,16,17,18,19,20,21/SDA,22/SCL,23,25,26,27,32,33,34,35,36,39,GND
NEBULA:A[0..15],B[0..15],C[0..15],D[0..15],E[0..15],F[0..15],G[0..15],H[0..15]

## Notes on the sheet
- i2c 0x20 | i2c 0x21 | i2c 0x22 | i2c 0x23 | i2c 0x24 | i2c 0x25 | i2c 0x26 | i2c 0x27

## Library data of the parts
ACCESSORY ACCESSORY_GPIO JTAG = pinhead:PINHD-1X5: PIN HEADER
C1-C3 C5 C7-C13 C34 = rcl:C-US: CAPACITOR, American symbol; LCSC_PART: C19702; SPICEPREFIX: C
C4 C14-C33 = rcl:C-US: CAPACITOR, American symbol; LCSC_PART: C15849; SPICEPREFIX: C
D1 D2 D6 D10 D14 D18 D22 D26 D30 D34 D38 D42 D46 D53 D57 D61 D65 D69 D73 D77 = SparkFun-LED:LED: LED (Generic) Standard schematic elements and footprints for 5mm, 3mm, 1206, and 0603 sized LEDs. Generic LEDs with no color specified.; LCSC_PART: C2286
D3 D7 D11 D15 D19 D23 D27 D31 D35 D39 D43 D47 D50 D54 D58 D62 D66 D70 D74 D78 = SparkFun-LED:LED: LED (Generic) Standard schematic elements and footprints for 5mm, 3mm, 1206, and 0603 sized LEDs. Generic LEDs with no color specified.; LCSC_PART: C72043
D4 D8 D12 D16 D20 D24 D28 D32 D36 D40 D44 D48 D51 D55 D59 D63 D67 D71 D75 D79 = SparkFun-LED:LED: LED (Generic) Standard schematic elements and footprints for 5mm, 3mm, 1206, and 0603 sized LEDs. Generic LEDs with no color specified.; LCSC_PART: C72041
D5 D9 D13 D17 D21 D25 D29 D33 D37 D41 D45 D49 D52 D56 D60 D64 D68 D72 D76 D80 = SparkFun-LED:LED: LED (Generic) Standard schematic elements and footprints for 5mm, 3mm, 1206, and 0603 sized LEDs. Generic LEDs with no color specified.; LCSC_PART: C2290
GAME_INTERFACE = con-jst-ph:B12B-PH-K: HEADER
H1-H4 = holes:MOUNT-HOLE: MOUNTING HOLE with drill center marker
IC1 IC3-IC21 = maxim:MAX481CSA: RS485 TRANSEIVER; LCSC_PART: C8963; MF: MAXIM; MPN: MAX481CSA; OC_FARNELL: unknown; OC_NEWARK: 90C3817
IC2 = v-reg:LD117A?*: Low drop fixed and adjustable positive voltage regulators 1 A Source: http://www.st.com/stonline/products/literature/ds/7194/ld1117axx.pdf; LCSC_PART: C6187; PRICE: 0.5
J1 = SparkFun-Connectors:CONN_02: Multi connection point. Often used as Generic Header-pin footprint for 0.1 inch spaced/style header connections On any of the 0.1 inch spaced packages, you can populate with these: Break Away Headers - Straight <https://www.sparkfun.com/products/116> (PRT-00116) Break Away Male Headers - Right Angle <https://www.sparkfun.com/products/553> (PRT-00553) Female Headers <https://www.sparkfun.com/products/115> (PRT-00115) Break Away Headers - Machine Pin <https://www.sparkfun.com/products/117> (PRT-00117) Break Away Female Headers - Swiss Machine Pin <https://www.sparkfun.com/products/743> (PRT-00743) For SCREWTERMINALS and SPRING TERMINALS visit here: Screw Terimnals on SparkFun.com <https://www.sparkfun.com/search/results?term=Screw+Terminals> (5mm/3.5mm/2.54mm spacing) This device is also useful as a general connection point to wire up your design to another part of your project. Our various solder wires solder well into these plated through hole pads. Hook-Up Wire - Assortment (Stranded, 22 AWG) <https://www.sparkfun.com/products/11375> (PRT-11375) Hook-Up Wire - Assortment (Solid Core, 22 AWG) <https://www.sparkfun.com/products/11367> (PRT-11367) View the entire wire category on our website here <https://www.sparkfun.com/categories/141> Special notes: Molex polarized connector foot print use with: PRT-08233 with associated crimp pins and housings. 2.54_SCREWTERM for use with PRT-10571. 3.5mm Screw Terminal footprints for PRT-08084 5mm Screw Terminal footprints for use with PRT-08432; PROD_ID: CONN-09863; SKU: PRT-09914
LEDARRAY = SparkFun-Connectors:CONN_03: Multi connection point. Often used as Generic Header-pin footprint for 0.1 inch spaced/style header connections On any of the 0.1 inch spaced packages, you can populate with these: Break Away Headers - Straight <https://www.sparkfun.com/products/116> (PRT-00116) Break Away Male Headers - Right Angle <https://www.sparkfun.com/products/553> (PRT-00553) Female Headers <https://www.sparkfun.com/products/115> (PRT-00115) Break Away Headers - Machine Pin <https://www.sparkfun.com/products/117> (PRT-00117) Break Away Female Headers - Swiss Machine Pin <https://www.sparkfun.com/products/743> (PRT-00743) Stackable Header - 3 Pin (Female, 0.1") <https://www.sparkfun.com/products/13875> (PRT-13875) For SCREWTERMINALS and SPRING TERMINALS visit here: Screw Terimnals on SparkFun.com <https://www.sparkfun.com/search/results?term=Screw+Terminals> (5mm/3.5mm/2.54mm spacing) This device is also useful as a general connection point to wire up your design to another part of your project. Our various solder wires solder well into these plated through hole pads. Hook-Up Wire - Assortment (Stranded, 22 AWG) <https://www.sparkfun.com/products/11375> (PRT-11375) Hook-Up Wire - Assortment (Solid Core, 22 AWG) <https://www.sparkfun.com/products/11367> (PRT-11367) View the entire wire category on our website here <https://www.sparkfun.com/categories/141> Special notes: Molex polarized connector foot print use with SKU : PRT-08232 with associated crimp pins and housings.
NEBULA_A NEBULA_B NEBULA_C NEBULA_D NEBULA_E NEBULA_F NEBULA_G NEBULA_H = MCP23017-E_SO:MCP23017-E/SO: MCP23017 Series 5.5 V 1.7 MHz SMT 16-Bit I2C I/O Expander - SOIC-28 Check availability <https://pricing.snapeda.com/parts/MCP23017-E/SO/Microchip/view-part?ref=eda>; AVAILABILITY: In Stock; DESCRIPTION: I/O Expander 16 I²C 1.7 MHz 28-SOIC; LCSC_PART: C629440; MF: Microchip; MP: MCP23017-E/SO; PACKAGE: SOIC-28 Microchip; PRICE: None; PURCHASE-URL: https://pricing.snapeda.com/search/part/MCP23017-E/SO/?ref=eda
POWER_IN = con-phoenix-508:MKDSN1,5/4-5,08: MKDSN 1,5/ 4-5,08 Printklemme Nennstrom: 13,5 A Nennspannung: 250 V Rastermaß: 5,08 mm Polzahl: 4 Anschlussart: Schraubanschluss Montage: Löten Anschlussrichtung Leiter/Platine: 0 ° Artikelnummer: 1729144 Source: http://eshop.phoenixcontact.com .. 1729144.pdf
R3-R106 = rcl:R-US_: RESISTOR, American symbol; LCSC_PART: C25804; SPICEPREFIX: R
STAR_1-STAR_20 = con-jst-ph:B8B-PH-K: HEADER
U$1 = ESP32-DEVKITV1:ESP32DEVKITV1
ULN1 = SparkFun-IC-Special-Function:ULN2803: Darlington Driver(IC-07959, low stock) ULN2803 Darlington array. 500mA max per channel, 8-channel package. Spark Fun Electronics SKU : COM-00312

## Net classes
0 default: width 0.305 mm, clearance 0.254 mm
1 GND: width 0.508 mm, clearance 0.254 mm
2 12V: width 1.27 mm, clearance 0.254 mm
3 5V: width 1.27 mm, clearance 0.254 mm
4 3V3: width 0.508 mm, clearance 0.254 mm
5 12V_FUSED: width 0.635 mm, clearance 0.254 mm